# Altium schematic sheet Power_Bypass_Caps.SchDoc: Power Supply Bypass Capacitors
size A4; DocumentNumber: 10; SheetNumber: 10; SheetTotal: 12
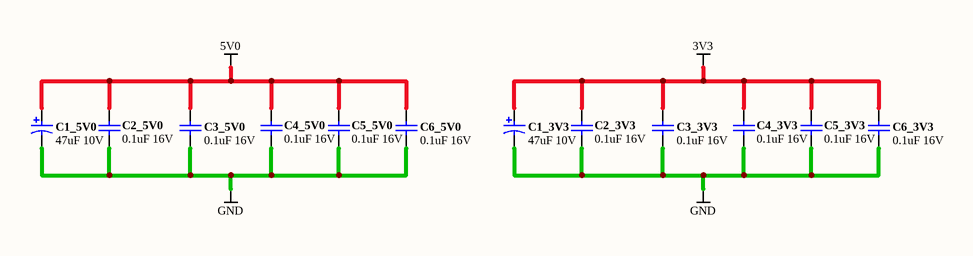
[diagram p0: Power_Bypass_Caps.SchDoc]

## Parts
C1_3V3  47uF 10V  [CAPC3528-STAR]
C1_5V0  47uF 10V  [CAPC3528-STAR]
C2_3V3  0.1uF 16V  [CAPC1005-STAR]
C2_5V0  0.1uF 16V  [CAPC1005-STAR]
C3_3V3  0.1uF 16V  [CAPC1005-STAR]
C3_5V0  0.1uF 16V  [CAPC1005-STAR]
C4_3V3  0.1uF 16V  [CAPC1005-STAR]
C4_5V0  0.1uF 16V  [CAPC1005-STAR]
C5_3V3  0.1uF 16V  [CAPC1005-STAR]
C5_5V0  0.1uF 16V  [CAPC1005-STAR]
C6_3V3  0.1uF 16V  [CAPC1005-STAR]
C6_5V0  0.1uF 16V  [CAPC1005-STAR]

## Nets
3V3: C1_3V3.1 C2_3V3.2 C3_3V3.1 C4_3V3.2 C5_3V3.2 C6_3V3.1
5V0: C1_5V0.1 C2_5V0.2 C3_5V0.1 C4_5V0.2 C5_5V0.2 C6_5V0.1
GND: C1_3V3.2 C1_5V0.2 C2_3V3.1 C2_5V0.1 C3_3V3.2 C3_5V0.2 C4_3V3.1 C4_5V0.1 C5_3V3.1 C5_5V0.1 C6_3V3.2 C6_5V0.2

## Notes on the sheet
- Sheet Title
- Project Title
- Size:
- Date:
- A4
- Assy:
- Time:
- Revision:
- Sheet
- of
- File:

## Library data of the parts
C1_3V3 C1_5V0 = D-101-0001: Capacitor, Tantalum, 47uF 20% 10V MCCT-B (3528-12); Polarity: Polarized; Category: Capacitor; Capacitance: 47 uF; Mounting Technology: Surface Mount; Rated Voltage: 10 V; Status: Deprecated; Technology: Tantalum; Tolerance: 20 %
C2_3V3 C2_5V0 C3_3V3 C3_5V0 C4_3V3 C4_5V0 C5_3V3 C5_5V0 C6_3V3 C6_5V0 = D-101-0080: Capacitor, Ceramic, 0.1uF 10% 16V 0402 (1005) X7R; Polarity: Non-Polarized; Category: Capacitor; Capacitance: 0.1 uF; Dielectric: X7R; Mounting Technology: Surface Mount; Rated Voltage: 16 V; Status: Production; Technology: Ceramic; Tolerance: 10 %